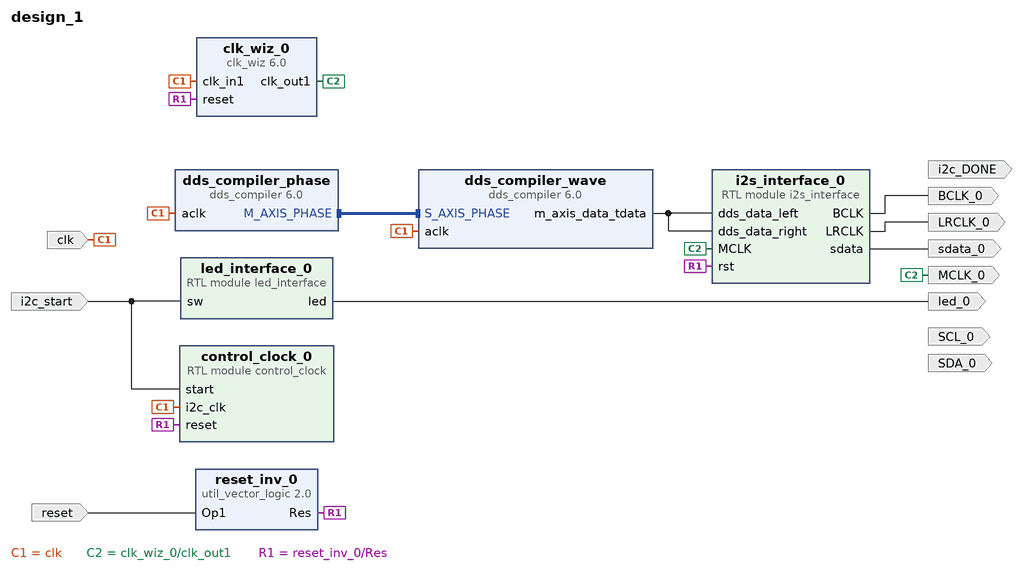
[diagram p0: block diagram of the top level]
# Vivado block design design_1, xc7a200tsbg484-1, Vivado 2023.1
create_bd_design design_1

create_bd_port -dir I -type clk clk
set_property -dict {CONFIG.FREQ_HZ 100000000} [get_bd_ports clk]
create_bd_port -dir I -type rst reset
set_property -dict {CONFIG.POLARITY ACTIVE_LOW} [get_bd_ports reset]
create_bd_port -dir O -type clk MCLK_0
create_bd_port -dir O -type clk BCLK_0
create_bd_port -dir O -type clk LRCLK_0
create_bd_port -dir O -type data sdata_0
create_bd_port -dir O -type clk SCL_0
create_bd_port -dir O i2c_DONE
create_bd_port -dir O SDA_0
create_bd_port -dir I i2c_start
create_bd_port -dir O led_0

create_bd_cell -type ip -vlnv xilinx.com:ip:clk_wiz:6.0 clk_wiz_0
set_property -dict [list \
  CONFIG.CLKOUT1_JITTER 448.322 \
  CONFIG.CLKOUT1_PHASE_ERROR 335.207 \
  CONFIG.CLKOUT1_REQUESTED_OUT_FREQ 24.576 \
  CONFIG.MMCM_CLKFBOUT_MULT_F 34.250 \
  CONFIG.MMCM_CLKOUT0_DIVIDE_F 27.875 \
  CONFIG.MMCM_DIVCLK_DIVIDE 5 \
  CONFIG.RESET_BOARD_INTERFACE reset \
  CONFIG.USE_BOARD_FLOW true \
  CONFIG.USE_LOCKED true \
] [get_bd_cells clk_wiz_0]
create_bd_cell -type ip -vlnv xilinx.com:ip:dds_compiler:6.0 dds_compiler_wave
set_property -dict [list \
  CONFIG.DATA_Has_TLAST Not_Required \
  CONFIG.Has_Phase_Out false \
  CONFIG.Latency 6 \
  CONFIG.M_DATA_Has_TUSER Not_Required \
  CONFIG.Noise_Shaping None \
  CONFIG.Output_Frequency1 0 \
  CONFIG.Output_Selection Sine \
  CONFIG.Output_Width 16 \
  CONFIG.PINC1 0 \
  CONFIG.Parameter_Entry Hardware_Parameters \
  CONFIG.PartsPresent SIN_COS_LUT_only \
  CONFIG.Phase_Width 16 \
  CONFIG.S_PHASE_Has_TUSER Not_Required \
] [get_bd_cells dds_compiler_wave]
create_bd_cell -type ip -vlnv xilinx.com:ip:dds_compiler:6.0 dds_compiler_phase
set_property -dict [list \
  CONFIG.DATA_Has_TLAST Not_Required \
  CONFIG.Latency 1 \
  CONFIG.M_DATA_Has_TUSER Not_Required \
  CONFIG.Noise_Shaping None \
  CONFIG.Output_Frequency1 0 \
  CONFIG.Output_Width 3 \
  CONFIG.PINC1 1000 \
  CONFIG.Parameter_Entry Hardware_Parameters \
  CONFIG.PartsPresent Phase_Generator_only \
  CONFIG.Phase_Width 16 \
  CONFIG.S_PHASE_Has_TUSER Not_Required \
] [get_bd_cells dds_compiler_phase]
create_bd_cell -type ip -vlnv xilinx.com:ip:util_vector_logic:2.0 reset_inv_0
set_property -dict {CONFIG.C_OPERATION not CONFIG.C_SIZE 1} [get_bd_cells reset_inv_0]
create_bd_cell -type module -reference i2s_interface i2s_interface_0
create_bd_cell -type module -reference led_interface led_interface_0
create_bd_cell -type module -reference control_clock control_clock_0

# ---- connections ----

connect_bd_intf_net [get_bd_intf_pins dds_compiler_phase/M_AXIS_PHASE] [get_bd_intf_pins dds_compiler_wave/S_AXIS_PHASE]
connect_bd_net [get_bd_ports clk] \
  [get_bd_pins dds_compiler_phase/aclk] [get_bd_pins dds_compiler_wave/aclk] [get_bd_pins clk_wiz_0/clk_in1] \
  [get_bd_pins control_clock_0/i2c_clk]
connect_bd_net [get_bd_pins clk_wiz_0/clk_out1] [get_bd_ports MCLK_0] [get_bd_pins i2s_interface_0/MCLK]
connect_bd_net [get_bd_pins dds_compiler_wave/m_axis_data_tdata] \
  [get_bd_pins i2s_interface_0/dds_data_left] [get_bd_pins i2s_interface_0/dds_data_right]
connect_bd_net [get_bd_ports i2c_start] [get_bd_pins led_interface_0/sw] [get_bd_pins control_clock_0/start]
connect_bd_net [get_bd_pins i2s_interface_0/BCLK] [get_bd_ports BCLK_0]
connect_bd_net [get_bd_pins i2s_interface_0/LRCLK] [get_bd_ports LRCLK_0]
connect_bd_net [get_bd_pins i2s_interface_0/sdata] [get_bd_ports sdata_0]
connect_bd_net [get_bd_pins led_interface_0/led] [get_bd_ports led_0]
connect_bd_net [get_bd_ports reset] [get_bd_pins reset_inv_0/Op1]
connect_bd_net [get_bd_pins reset_inv_0/Res] [get_bd_pins clk_wiz_0/reset] [get_bd_pins i2s_interface_0/rst] [get_bd_pins control_clock_0/reset]

validate_bd_design
save_bd_design
